# EAGLE schematic Cricket_Re (EAGLE 6.0)
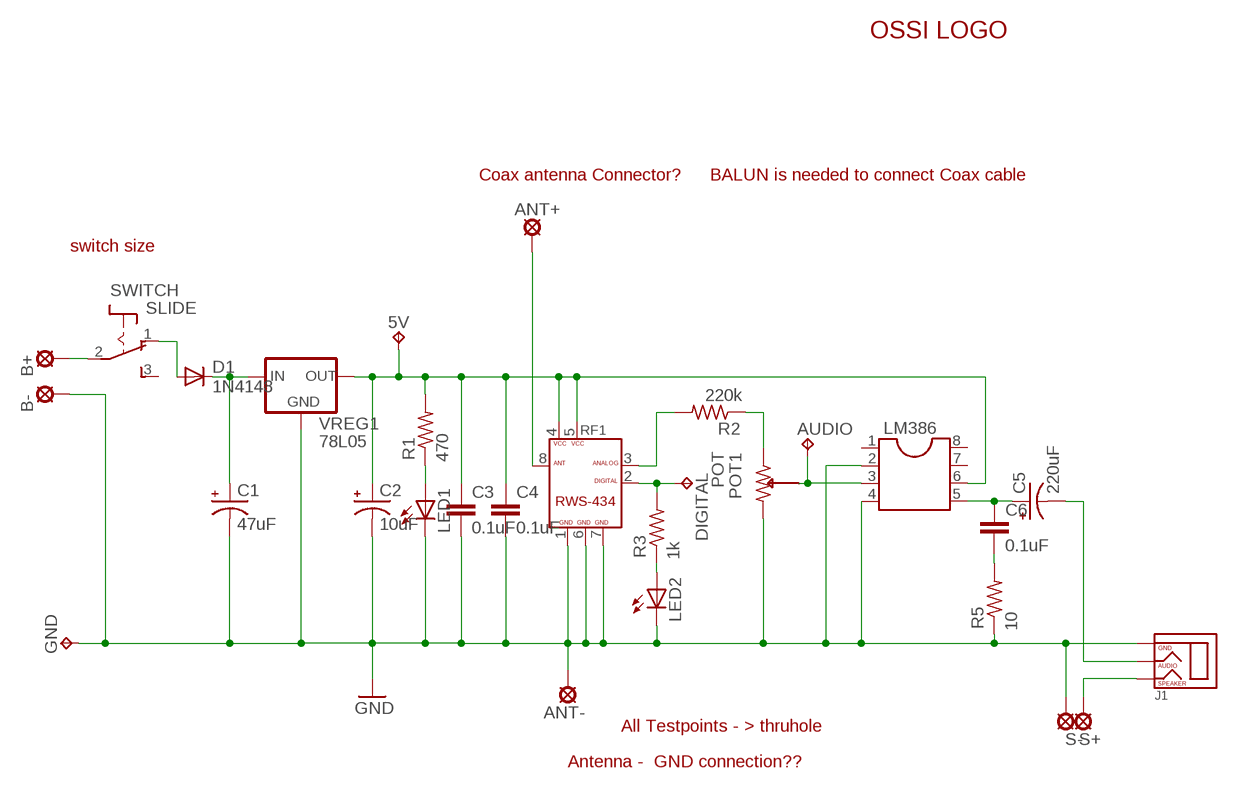
[diagram p0: schematic, sheet 1]

## Parts
5V  TPB1,27  [B1,27]
ANT+  FIXPAD  [FIXPAD]
ANT-  FIXPAD  [FIXPAD]
AUDIO  TPB1,27  [B1,27]
B+  FIXPAD  [FIXPAD]
B-  FIXPAD  [FIXPAD]
C1  47uF  CAPACITOR_POLR5  [CAPACITOR_POL]
C2  10uF  CAPACITOR_POLR5  [CAPACITOR_POL]
C3  0.1uF  CAPACITOR  [CAPACITOR]
C4  0.1uF  CAPACITOR  [CAPACITOR]
C5  220uF  CAPACITOR_POLR10  [CAPACITOR_POL_R10]
C6  0.1uF  CAPACITOR  [CAPACITOR]
D1  1N4148  [1N4148]
DIGITAL  TPB1,27  [B1,27]
GND  TPB1,27  [B1,27]
J1  AUDIOJACK  [AUDIOJACK]
LED1  LED  [LED]
LED2  LED  [LED]
LM386  DIL8  [DIL08]
POT1  POT  [POT]
R1  470  RESISTOR  [RESISTOR]
R2  220k  RESISTOR  [RESISTOR]
R3  1k  RESISTOR  [RESISTOR]
R5  10  RESISTOR  [RESISTOR]
RF1  RWS-434  [RWS-434]
S+  FIXPAD  [FIXPAD]
S-  FIXPAD  [FIXPAD]
SWITCH  SLIDE  [SLIDE]
U$1  OSSILOGO-10  [OSSILOGO1010]
VREG1  78L05  [78L05]

## Nets
C1 [power]: C1.+ D1.C VREG1.I(IN)
C3 [power]: 5V.PP(TP) C2.+ C3.P$1 C4.P$1 LM386.6 R1.P$2 RF1.4 RF1.5 VREG1.O(OUT)
C5 [power]: C5.+ C6.P$1 LM386.5
GND [power]: ANT-.P$1(MP) B-.P$1(MP) C1.- C2.- C3.P$2 C4.P$2 GND.PP(TP) J1.G(GND) LED1.C LED2.C LM386.2 LM386.4 POT1.2 R5.P$1 RF1.1 RF1.6 RF1.7 S-.P$1(MP) VREG1.G(GND)
N$1: D1.A SWITCH.1(O)
N$2 [power]: B+.P$1(MP) SWITCH.2(P)
N$4: LED2.A R3.P$1
N$5: DIGITAL.PP(TP) R3.P$2 RF1.2
N$6: POT1.1 R2.P$1
N$7: LED1.A R1.P$1
N$8 [power]: ANT+.P$1(MP) RF1.8
N$9 [power]: C5.- J1.A(AUDIO)
N$10: AUDIO.PP(TP) LM386.3 POT1.C(CENTER)
N$11: R2.P$2 RF1.3
N$12: C6.P$2 R5.P$2
SPK2 [power]: J1.S(SPEAKER) S+.P$1(MP)
Unconnected: LM386.1 LM386.7 LM386.8 SWITCH.3(S)

## Notes on the sheet
- Coax antenna Connector? | BALUN is needed to connect Coax cable
- switch size
- All Testpoints - > thruhole
- Antenna -  GND connection??

## Library data of the parts
5V AUDIO DIGITAL GND = testpad:TP: Test pad
ANT+ ANT- B+ B- S+ S- = lbr\Hole:FIXPAD
C1 C2 C5 = RCcomponent:CAPACITOR_POL: Capacitor $ Kit
C3 C4 C6 = RCcomponent:CAPACITOR: Capacitor $ Kit
D1 = Power:1N4148: Diode $ Kit
J1 = Connector:AUDIOJACK: Audio Jack $ Kit
LED1 LED2 = Power:LED: LED $ Kit
LM386 = ic-package:DIL8: Dual In Line / Socket
POT1 = RCcomponent:POT: Volume Controller $ Kit
R1-R3 R5 = RCcomponent:RESISTOR: Resistor $ Kit
RF1 = RFmodule:RWS-434: RF Module
SWITCH = Switch:SLIDE
U$1 = OSSI:OSSILOGO
VREG1 = lbr\Power:78L05: Voltage Regulator $ Kit

## Net classes
1 power: width 0.762 mm, clearance 0.254 mm